# Altium schematic sheet FOC.SchDoc
size A4
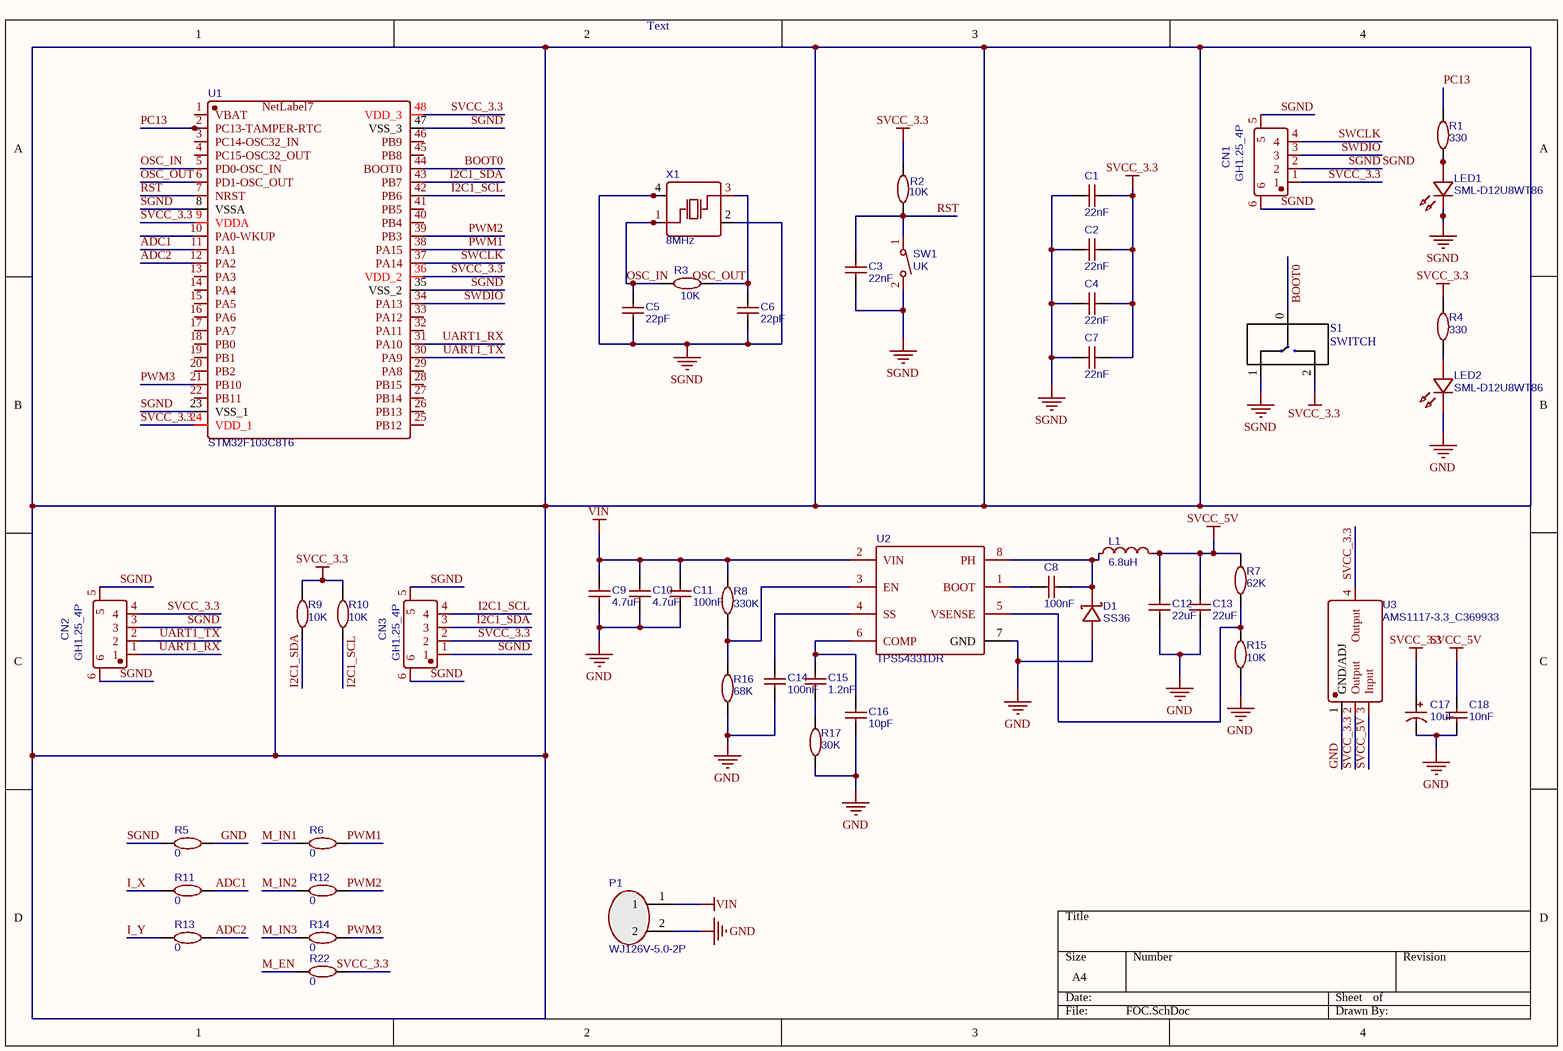
[diagram p0: FOC.SchDoc]

## Parts
C1  22nF  [C0603]
C2  22nF  [C0603]
C3  22nF  [C0603]
C4  22nF  [C0603]
C5  22pF  [C0603]
C6  22pF  [C0603]
C7  22nF  [C0603]
C8  100nF  [C0603]
C9  4.7uF  [C0603]
C10  4.7uF  [C0603]
C11  100nF  [C0603]
C12  22uF  [C0603]
C13  22uF  [C0603]
C14  100nF  [C0603]
C15  1.2nF  [C0603]
C16  10pF  [C0603]
C17  10uF  [CAP-SMD_L3.2-W1.6-RD]
C18  10nF  [C0603]
CN1  GH1.25_4P  [CONN-TH_4P-P1.25_HRS_DF13-4P-1.25H-21]
CN2  GH1.25_4P  [CONN-TH_4P-P1.25_HRS_DF13-4P-1.25H-21]
CN3  GH1.25_4P  [CONN-TH_4P-P1.25_HRS_DF13-4P-1.25H-21]
D1  SS36  [SMA_L4.3-W2.6-LS5.2-RD]
L1  6.8uH  [IND-SMD_L5.0-W5.0_SWPA5040S]
LED1  SML-D12U8WT86  [LED0603-RD]
LED2  SML-D12U8WT86  [LED0603-RD]
P1  WJ126V-5.0-2P  [CONN-TH_WJ126V-5.0-2P]
R1  330  [C0603]
R2  10K  [R0603]
R3  10K  [R0603]
R4  330  [C0603]
R5  0  [R0603]
R6  0  [R0603]
R7  62K  [R0603]
R8  330K  [R0603]
R9  10K  [R0603]
R10  10K  [R0603]
R11  0  [R0603]
R12  0  [R0603]
R13  0  [R0603]
R14  0  [R0603]
R15  10K  [R0603]
R16  68K  [R0603]
R17  30K  [R0603]
R22  0  [R0603]
S1  SWITCH  [switch]
SW1  UK  [SW-TH_L6.0-W3.5-P6.50]
U1  STM32F103C8T6  [LQFP-48_L7.0-W7.0-P0.50-LS9.0-BL]
U2  TPS54331DR  [SOIC-8_L5.0-W4.0-P1.27-LS6.0-BL]
U3  AMS1117-3.3_C369933  [SOT-223-4_L6.5-W3.5-P2.30-LS7.0-BR]
X1  8MHz  [CRYSTAL-SMD_4P-L5.0-W3.2-BL]

## Nets
GND: C9.1 C10.1 C11.1 C12.1 C13.1 C14.1 C16.1 C17.2 C18.1 D1.2(A) LED2.1(K) P1.2 R5.2 R15.1 R16.1 R17.1 U2.7(GND) U3.1(GND/ADJ)
SGND: C1.1 C2.1 C3.1 C4.1 C5.1 C6.1 C7.1 CN1.2 CN1.5 CN1.6 CN2.3 CN2.5 CN2.6 CN3.1 CN3.5 CN3.6 LED1.1(K) R5.1 S1.1 SW1.2 U1.8(VSSA) U1.23(VSS_1) U1.35(VSS_2) U1.47(VSS_3) X1.2(GND) X1.4(GND)
SVCC_3.3: C1.2 C2.2 C4.2 C7.2 C17.1 CN1.1 CN2.4 CN3.2 R2.1 R4.2 R9.2 R10.2 R22.2 S1.2 U1.9(VDDA) U1.24(VDD_1) U1.36(VDD_2) U1.48(VDD_3) U3.2(Output) U3.4(Output)
SVCC_5V: C12.2 C13.2 C18.2 L1.2 R7.2 U3.3(Input)
VIN: C9.2 C10.2 C11.2 P1.1 R8.2 U2.2(VIN)
ADC1: R11.2 U1.11(PA1)
ADC2: R13.2 U1.12(PA2)
BOOT0: S1.0 U1.44(BOOT0)
I2C1_SCL: CN3.4 R10.1 U1.42(PB6)
I2C1_SDA: CN3.3 R9.1 U1.43(PB7)
I_X: R11.1
I_Y: R13.1
M_EN: R22.1
M_IN1: R6.1
M_IN2: R12.1
M_IN3: R14.1
OSC_IN: C5.2 R3.1 U1.5(PD0-OSC_IN) X1.1(OSC1)
OSC_OUT: C6.2 R3.2 U1.6(PD1-OSC_OUT) X1.3(OSC2)
PC13: R1.2 U1.2(PC13-TAMPER-RTC)
PWM1: R6.2 U1.38(PA15)
PWM2: R12.2 U1.39(PB3)
PWM3: R14.2 U1.21(PB10)
RST: C3.2 R2.2 SW1.1 U1.7(NRST)
SWCLK: CN1.4 U1.37(PA14)
SWDIO: CN1.3 U1.34(PA13)
UART1_RX: CN2.1 U1.31(PA10)
UART1_TX: CN2.2 U1.30(PA9)
NetC8_1: C8.1 D1.1(K) L1.1 U2.8(PH)
NetC8_2: C8.2 U2.1(BOOT)
NetC14_2: C14.2 U2.4(SS)
NetC15_1: C15.1 R17.2
NetC15_2: C15.2 C16.2 U2.6(COMP)
NetLED1_2: LED1.2(A) R1.1
NetLED2_2: LED2.2(A) R4.1
NetR7_1: R7.1 R15.2 U2.5(VSENSE)
NetR8_1: R8.1 R16.2 U2.3(EN)

Not connected (* = marked no-connect by the designer): U1 1(VBAT) 3(PC14-OSC32_IN) 4(PC15-OSC32_OUT) 10(PA0-WKUP) 13(PA3) 14(PA4) 15(PA5) 16(PA6) 17(PA7) 18(PB0) 19(PB1) 20(PB2) 22(PB11) 25(PB12) 26(PB13) 27(PB14) 28(PB15) 29(PA8) 32(PA11) 33(PA12) 40(PB4) 41(PB5) 45(PB8) 46(PB9)

## Notes on the sheet
- Text
- Labels drawn without touching a wire or pin: NetLabel7, SGND

## Library data of the parts
C1-C4 C7 = 22nF: BOM_Manufacturer Part: CC0805KRX7R9BB104; BOM_Manufacturer: YAGEO; nameAlias: Capacitance; BOM_Supplier: LCSC; BOM_Supplier Part: C49678; BOM_JLCPCB Part Class: Basic Part; spicePre: C; spiceSymbolName: CC0805KRX7R9BB104
C5 C6 = 22pF: BOM_Manufacturer Part: CC0805KRX7R9BB104; BOM_Manufacturer: YAGEO; nameAlias: Capacitance; BOM_Supplier: LCSC; BOM_Supplier Part: C49678; BOM_JLCPCB Part Class: Basic Part; spicePre: C; spiceSymbolName: CC0805KRX7R9BB104
C8 C11 C14 = 100nF: BOM_Manufacturer Part: CC0805KRX7R9BB104; BOM_Manufacturer: YAGEO; nameAlias: Capacitance; BOM_Supplier: LCSC; BOM_Supplier Part: C49678; BOM_JLCPCB Part Class: Basic Part; spicePre: C; spiceSymbolName: CC0805KRX7R9BB104
C9 C10 = 4.7uF: BOM_Manufacturer Part: CC0805KRX7R9BB104; BOM_Manufacturer: YAGEO; nameAlias: Capacitance; BOM_Supplier: LCSC; BOM_Supplier Part: C49678; BOM_JLCPCB Part Class: Basic Part; spicePre: C; spiceSymbolName: CC0805KRX7R9BB104
C12 C13 = 22uF: BOM_Manufacturer Part: CC0805KRX7R9BB104; BOM_Manufacturer: YAGEO; nameAlias: Capacitance; BOM_Supplier: LCSC; BOM_Supplier Part: C49678; BOM_JLCPCB Part Class: Basic Part; spicePre: C; spiceSymbolName: CC0805KRX7R9BB104
C15 = 1.2nF: BOM_Manufacturer Part: CC0805KRX7R9BB104; BOM_Manufacturer: YAGEO; nameAlias: Capacitance; BOM_Supplier: LCSC; BOM_Supplier Part: C49678; BOM_JLCPCB Part Class: Basic Part; spicePre: C; spiceSymbolName: CC0805KRX7R9BB104
C16 = 10pF: BOM_Manufacturer Part: CC0805KRX7R9BB104; BOM_Manufacturer: YAGEO; nameAlias: Capacitance; BOM_Supplier: LCSC; BOM_Supplier Part: C49678; BOM_JLCPCB Part Class: Basic Part; spicePre: C; spiceSymbolName: CC0805KRX7R9BB104
C17 = 10uF: tan; BOM_Manufacturer: Xiangyee; BOM_Manufacturer Part: CA45-A016K106T; nameAlias: Capacitance; Contributor: LCSC; BOM_Supplier: LCSC; BOM_Supplier Part: C119051; BOM_JLCPCB Part Class: Extended Part; spicePre: C; spiceSymbolName: CA45-A016K106T
C18 = 10nF: BOM_Manufacturer: YAGEO; BOM_Manufacturer Part: CC0805KRX7R9BB104; nameAlias: Capacitance; BOM_Supplier: LCSC; BOM_Supplier Part: C49678; BOM_JLCPCB Part Class: Basic Part; spicePre: C; spiceSymbolName: CC0805KRX7R9BB104
CN1-CN3 = GH1.25_4P: BOM_Manufacturer: HRS(广濑); BOM_Manufacturer Part: DF13-4P-1.25H(21); Contributor: LCSC; BOM_Supplier: LCSC; BOM_Supplier Part: C597872; spicePre: C; spiceSymbolName: DF13-4P-1.25H(21)
D1 = SS36: BOM_Manufacturer: MDD; BOM_Supplier: LCSC; BOM_Manufacturer Part: SS36; BOM_Supplier Part: C16015; BOM_JLCPCB Part Class: Extended Part; spicePre: D; spiceSymbolName: SS36
L1 = 6.8uH: BOM_Manufacturer: Sunlord; BOM_Manufacturer Part: SWPA5040S6R8M; nameAlias: Inductance; BOM_Supplier: LCSC; BOM_Supplier Part: C36411; BOM_JLCPCB Part Class: Extended Part; spicePre: L; spiceSymbolName: SWPA5040S6R8M
LED1 LED2 = LED_1: 0603; BOM_Manufacturer: ROHM(罗姆); Contributor: LCSC; BOM_Supplier: LCSC; BOM_Supplier Part: C510027; BOM_Manufacturer Part: SML-D12U8WT86; BOM_JLCPCB Part Class: Extended Part; spicePre: L; spiceSymbolName: SML-D12U8WT86
P1 = WJ126V-5.0-2P: BOM_Manufacturer: ReliaPro; BOM_Supplier: LCSC; BOM_Manufacturer Part: WJ126V-5.0-2P; BOM_Supplier Part: C8404; BOM_JLCPCB Part Class: Extended Part; spicePre: P; spiceSymbolName: WJ126V-5.0-2P
R1 R4 = 330: BOM_Manufacturer: UniOhm; BOM_Manufacturer Part: 0805W8F1002T5E; nameAlias: Resistance (Ohms); BOM_Supplier: LCSC; BOM_Supplier Part: C17414; BOM_JLCPCB Part Class: Basic Part; spicePre: R; spiceSymbolName: 0805W8F1002T5E
R2 R3 R9 R10 R15 = 10K: BOM_Manufacturer: UniOhm; BOM_Manufacturer Part: 0805W8F1002T5E; nameAlias: Resistance (Ohms); BOM_Supplier: LCSC; BOM_Supplier Part: C17414; BOM_JLCPCB Part Class: Basic Part; spicePre: R; spiceSymbolName: 0805W8F1002T5E
R5 R6 R11-R14 R22 = 0: 0欧电阻; BOM_Manufacturer: UniOhm; BOM_Manufacturer Part: 0805W8F1002T5E; nameAlias: Resistance (Ohms); BOM_Supplier: LCSC; BOM_Supplier Part: C17414; BOM_JLCPCB Part Class: Basic Part; spicePre: R; spiceSymbolName: 0805W8F1002T5E
R7 = 62K: BOM_Manufacturer: UniOhm; BOM_Manufacturer Part: 0805W8F1002T5E; nameAlias: Resistance (Ohms); BOM_Supplier: LCSC; BOM_Supplier Part: C17414; BOM_JLCPCB Part Class: Basic Part; spicePre: R; spiceSymbolName: 0805W8F1002T5E
R8 = 330K: R0603; BOM_Manufacturer: UniOhm; BOM_Manufacturer Part: 0603WAF3303T5E; nameAlias: Resistance (Ohms); BOM_Supplier: LCSC; BOM_Supplier Part: C23137; BOM_JLCPCB Part Class: Basic Part; spicePre: R; spiceSymbolName: 0603WAF3303T5E
R16 = 68K: BOM_Manufacturer: UniOhm; BOM_Manufacturer Part: 0805W8F1002T5E; nameAlias: Resistance (Ohms); BOM_Supplier: LCSC; BOM_Supplier Part: C17414; BOM_JLCPCB Part Class: Basic Part; spicePre: R; spiceSymbolName: 0805W8F1002T5E
R17 = 30K: BOM_Manufacturer: UniOhm; BOM_Manufacturer Part: 0805W8F1002T5E; nameAlias: Resistance (Ohms); BOM_Supplier: LCSC; BOM_Supplier Part: C17414; BOM_JLCPCB Part Class: Basic Part; spicePre: R; spiceSymbolName: 0805W8F1002T5E
SW1 = UK-B0205G43-DP25Y: BOM_Manufacturer: USAKRO; Contributor: LCSC; BOM_Supplier: LCSC; BOM_Supplier Part: C493223; BOM_Manufacturer Part: UK-B0205G43-DP25Y; BOM_JLCPCB Part Class: Extended Part; spicePre: S; spiceSymbolName: UK-B0205G43-DP25Y
U1 = STM32F103C8T6: BOM_Manufacturer: STMicroelectronics; timeStamp: 1455028086; BOM_Supplier: LCSC; BOM_Manufacturer Part: STM32F103C8T6; BOM_Supplier Part: C8734; BOM_JLCPCB Part Class: Basic Part; spicePre: U; spiceSymbolName: STM32F103C8T6
U2 = TPS54331DR: 电源芯片; BOM_Manufacturer: TI; BOM_Supplier: LCSC; BOM_Manufacturer Part: TPS54331DR; BOM_Supplier Part: C9865; BOM_JLCPCB Part Class: Basic Part; spicePre: U; spiceSymbolName: TPS54331DR
U3 = AMS1117-3.3_C369933: BOM_Manufacturer: KEXIN; Contributor: LCSC; BOM_Supplier: LCSC; BOM_Supplier Part: C369933; BOM_Manufacturer Part: AMS1117-3.3; BOM_JLCPCB Part Class: Extended Part; spicePre: U; spiceSymbolName: AMS1117-3.3_C369933
X1 = 8MHz: BOM_Manufacturer: TXC Corp; BOM_Manufacturer Part: 7B08070003; nameAlias: Frequency; Contributor: LCSC; BOM_Supplier: LCSC; BOM_Supplier Part: C337573; spicePre: X; spiceSymbolName: 7B08070003